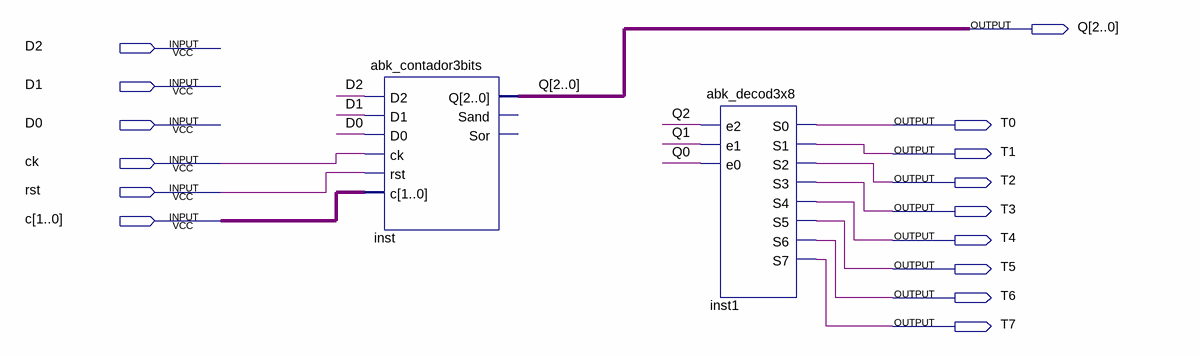
[diagram p0: schematic sheet]
// Quartus schematic abk_temporizador.bdf as structural Verilog: 2 symbols, 15 pins
module abk_temporizador (
  input  D2,
  input  D1,
  input  D0,
  input  ck,
  input  rst,
  input  [1:0] c,
  output [2:0] Q,
  output T0,
  output T1,
  output T2,
  output T3,
  output T4,
  output T5,
  output T6,
  output T7
);

  abk_contador3bits inst (.D2(D2), .D1(D1), .D0(D0), .ck(ck), .rst(rst), .c(c), .Q(Q));  // open: Sand, Sor
  abk_decod3x8 inst1 (
    .e2(Q[2]), .e1(Q[1]), .e0(Q[0]), .S0(T0), .S1(T1), .S2(T2), .S3(T3), .S4(T4), .S5(T5), .S6(T6), .S7(T7));
endmodule
